# EAGLE design LogBoard (EAGLE 9.5.0)
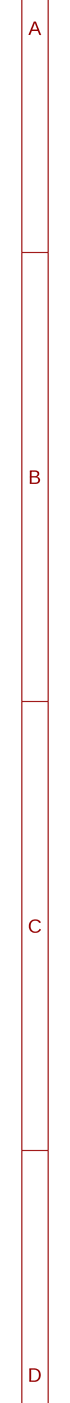
[diagram p0: schematic, sheet 1, part 1 of 2]
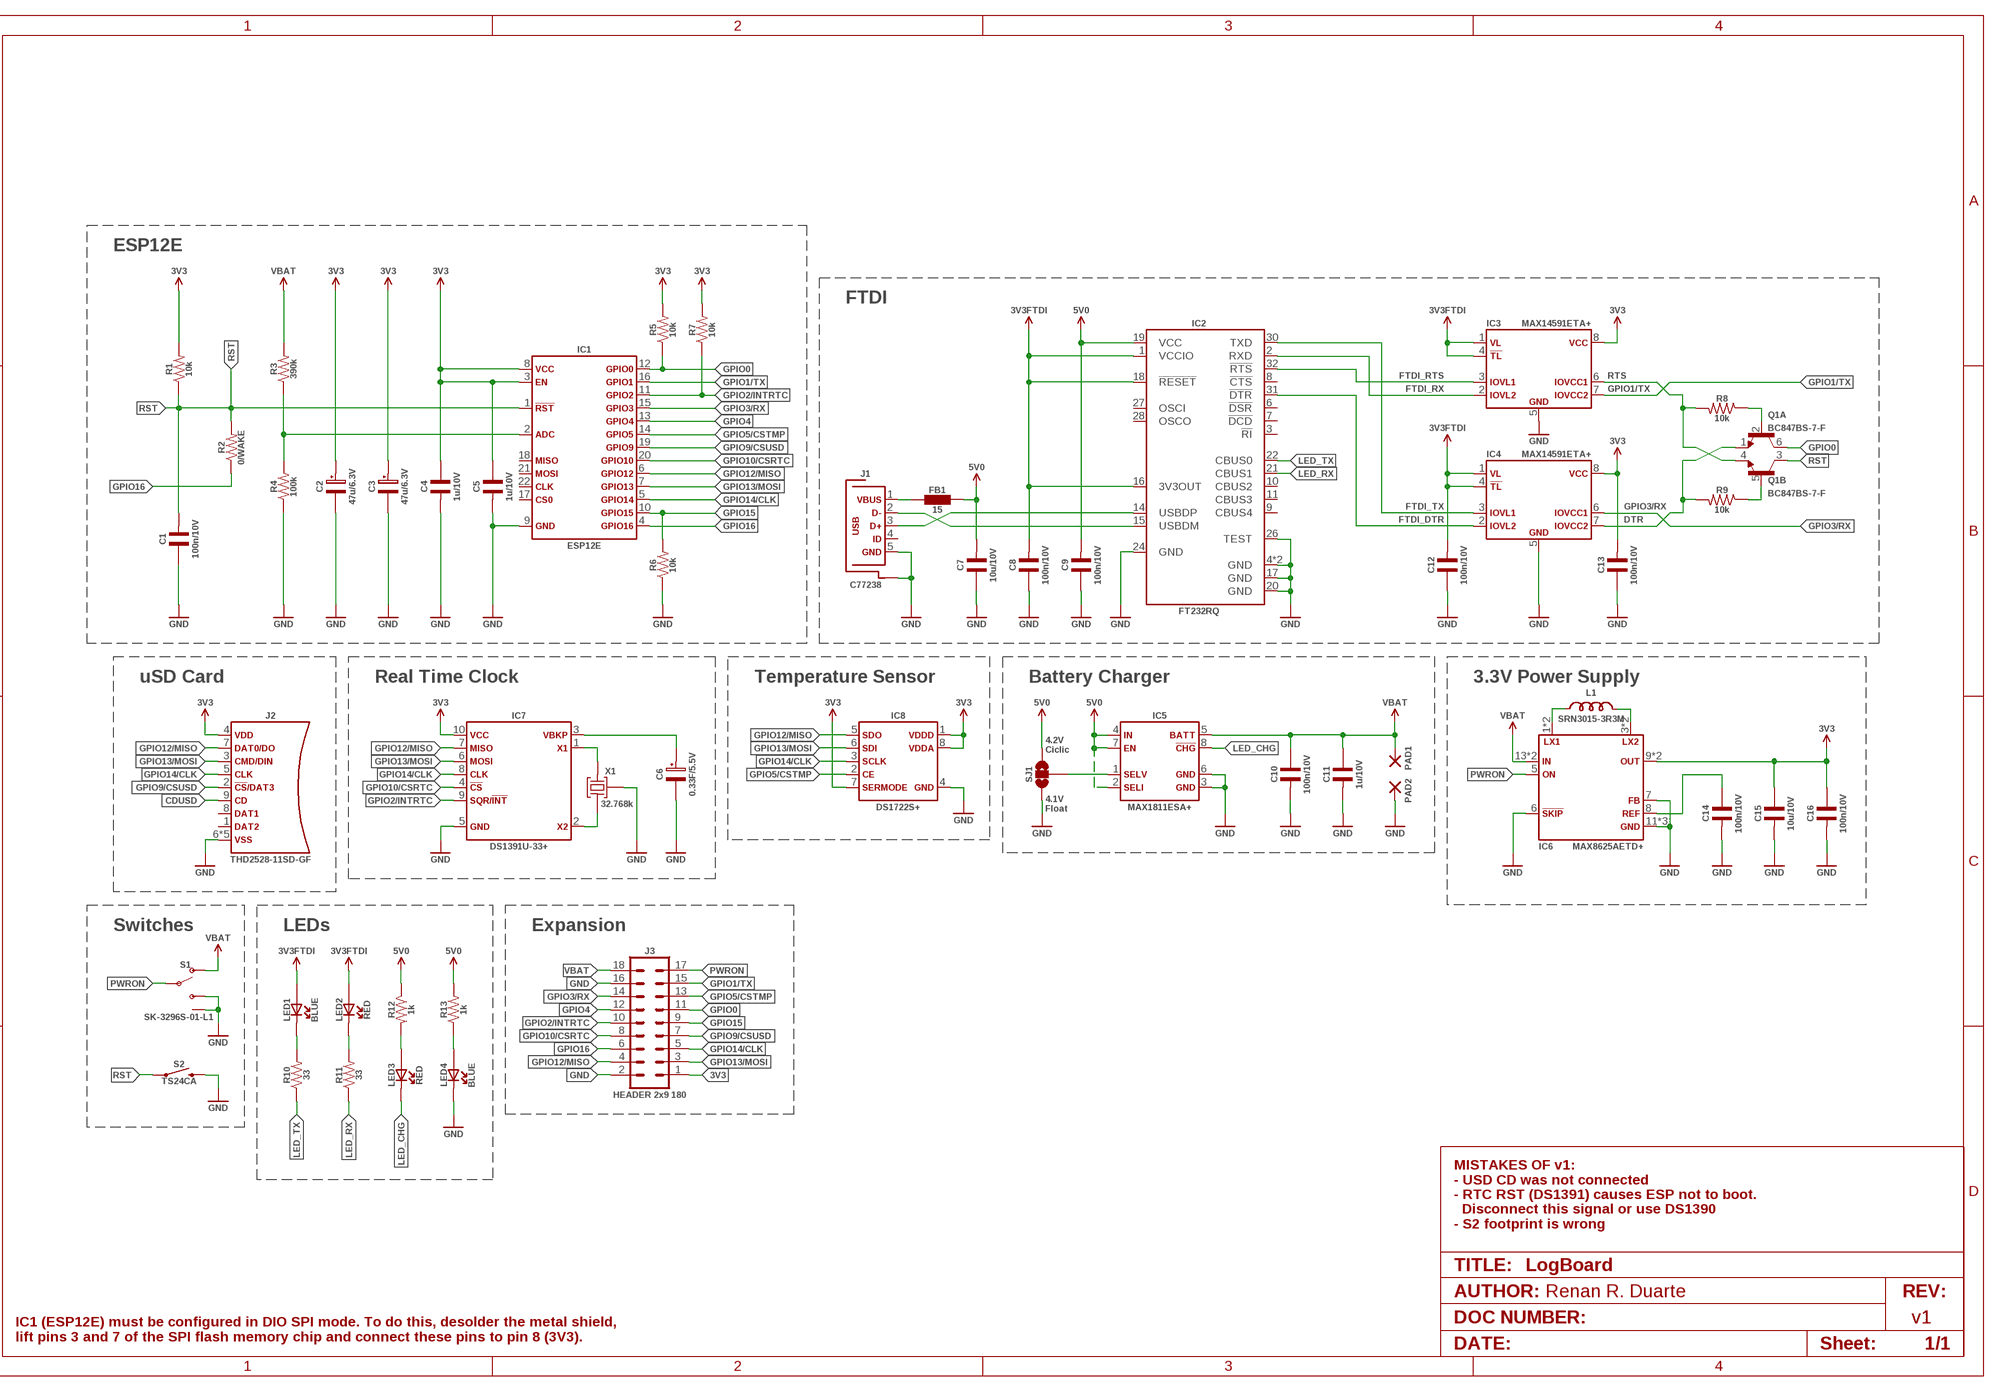
[diagram p1: schematic, sheet 1, part 2 of 2]

## Parts
C1  100n/10V  1-CAPACITORSMD-0603  [C-SMD-0603]
C2  47u/6.3V  1-CAPACITOR-POLCT3528  [C-SMD-CT3528]
C3  47u/6.3V  1-CAPACITOR-POLCT3528  [C-SMD-CT3528]
C4  1u/10V  1-CAPACITORSMD-0603  [C-SMD-0603]
C5  1u/10V  1-CAPACITORSMD-0603  [C-SMD-0603]
C6  0.33F/5.5V  1-CAPACITOR-POL5X11.5  [C-PTH-5X11.5]
C7  10u/10V  1-CAPACITORSMD-0603  [C-SMD-0603]
C8  100n/10V  1-CAPACITORSMD-0603  [C-SMD-0603]
C9  100n/10V  1-CAPACITORSMD-0603  [C-SMD-0603]
C10  100n/10V  1-CAPACITORSMD-0603  [C-SMD-0603]
C11  1u/10V  1-CAPACITORSMD-0603  [C-SMD-0603]
C12  100n/10V  1-CAPACITORSMD-0603  [C-SMD-0603]
C13  100n/10V  1-CAPACITORSMD-0603  [C-SMD-0603]
C14  100n/10V  1-CAPACITORSMD-0603  [C-SMD-0603]
C15  10u/10V  1-CAPACITORSMD-0603  [C-SMD-0603]
C16  100n/10V  1-CAPACITORSMD-0603  [C-SMD-0603]
FB1  15  FB-0603  [R-SMD-0603]
IC1  ESP12E  IC-ESP8266-12E*  [IC-ESP8266-12E]
IC2  FT232RQ  IC-FT232RQ  [IC-QFN32]
IC3  MAX14591ETA+  IC-MAX14591  [IC-TDFN8]
IC4  MAX14591ETA+  IC-MAX14591  [IC-TDFN8]
IC5  MAX1811ESA+  IC-MAX1811  [IC-SO8]
IC6  MAX8625AETD+  IC-MAX8625  [IC-TDFN14]
IC7  DS1391U-33+  IC-DS1394  [IC-USOP10]
IC8  DS1722S+  IC-DS1722  [IC-SO8]
J1  C77238  CN-MICRO-USB  [CN-MICRO-USB]
J2  THD2528-11SD-GF  CN-MICROSD  [CN-MICROSD]
J3  HEADER 2x9 180  PIN-HEADER-9X2  [PH-9X2-180]
L1  SRN3015-3R3M  2-INDUCTOR3X3  [L-SMD-3X3]
LED1  BLUE  LED0603  [LED-SMD-0603]
LED2  RED  LED0603  [LED-SMD-0603]
LED3  RED  LED0603  [LED-SMD-0603]
LED4  BLUE  LED0603  [LED-SMD-0603]
PAD1  SMD2  [SMD1,27-2,54]
PAD2  SMD2  [SMD1,27-2,54]
Q1  BC847BS-7-F  NPN-DUAL  [IC-SOT363]
R1  10k  0-RESISTORSMD-0603  [R-SMD-0603]
R2  0/WAKE  0-RESISTORSMD-0603  [R-SMD-0603]
R3  390k  0-RESISTORSMD-0603  [R-SMD-0603]
R4  100k  0-RESISTORSMD-0603  [R-SMD-0603]
R5  10k  0-RESISTORSMD-0603  [R-SMD-0603]
R6  10k  0-RESISTORSMD-0603  [R-SMD-0603]
R7  10k  0-RESISTORSMD-0603  [R-SMD-0603]
R8  10k  0-RESISTORSMD-0603  [R-SMD-0603]
R9  10k  0-RESISTORSMD-0603  [R-SMD-0603]
R10  33  0-RESISTORSMD-0603  [R-SMD-0603]
R11  33  0-RESISTORSMD-0603  [R-SMD-0603]
R12  1k  0-RESISTORSMD-0603  [R-SMD-0603]
R13  1k  0-RESISTORSMD-0603  [R-SMD-0603]
S1  SK-3296S-01-L1  SWITCH-SPDT-SMD-RIGHT-ANGLE  [SWITCH_SPST_SMD_A]
S2  TS24CA  MOMENTARY-SWITCH-SPST-SMD-RIGHT-ANGLE  [TACTILE_SWITCH_SMD_RIGHT_ANGLE]
SJ1  SJ-3  [SJ-3]
X1  32.768k  CRYSTAL  [CRYSTAL-SMD-7X1.5]

## Nets
3V3: C2.+(P) C3.+(P) C4.P$1 C5.P$1 C13.P$2 C15.P$1 C16.P$1 IC1.3(EN) IC1.8(VCC) IC3.8(VCC) IC4.8(VCC) IC6.9(OUT) IC6.10(OUT) IC7.10(VCC) IC8.1(VDDD) IC8.7(SERMODE) IC8.8(VDDA) J2.4(VDD) J3.1 R1.P$2 R5.P$2 R7.P$2
3V3FTDI: C8.P$2 C12.P$2 IC2.1(VCCIO) IC2.16(3V3OUT) IC2.18(!RESET) IC3.1(VL) IC3.4(!TL) IC4.1(VL) IC4.4(!TL) LED1.A LED2.A
5V0: C7.P$2 C9.P$2 FB1.P$2 IC2.19(VCC) IC5.2(SELI) IC5.4(IN) IC5.7(EN) R12.P$1 R13.P$2 SJ1.1
CDUSD: J2.9(CD)
DTR: IC4.7(IOVCC2) Q1.1(A:E) R9.P$2
FTDI_DTR: IC2.31(!DTR) IC4.2(IOVL2)
FTDI_RTS: IC2.32(!RTS) IC3.3(IOVL1)
FTDI_RX: IC2.2(RXD) IC3.2(IOVL2)
FTDI_TX: IC2.30(TXD) IC4.3(IOVL1)
GND: C1.P$1 C2.-(N) C3.-(N) C4.P$2 C5.P$2 C6.N C7.P$1 C8.P$1 C9.P$1 C10.P$2 C11.P$2 C12.P$1 C13.P$1 C14.P$2 C15.P$2 C16.P$2 IC1.9(GND) IC2.4(GND) IC2.17(GND) IC2.20(GND) IC2.24(GND) IC2.26(TEST) IC2.GND IC3.5(GND) IC4.5(GND) IC5.3(GND) IC5.6(GND) IC6.6(!SKIP) IC6.7(FB) IC6.11(GND) IC6.12(GND) IC6.TP(GND) IC7.5(GND) IC8.4(GND) J1.5(GND) J1.SHELL1(SHIELD) J1.SHELL2(SHIELD) J1.SHELL3(SHIELD) J1.SHELL(SHIELD) J2.6(VSS) J2.G1(VSS) J2.G2(VSS) J2.G3(VSS) J2.G4(VSS) J3.2 J3.16 LED4.C PAD2.1(P) R4.P$1 R6.P$1 S1.3(S) S1.GND1 S1.GND2 S1.GND3 S1.GND4 S2.2 SJ1.3 X1.3 X1.4
GPIO0: IC1.12(GPIO0) J3.11 Q1.6(A:C) R5.P$1
GPIO1/TX: IC1.16(GPIO1) IC3.7(IOVCC2) J3.15
GPIO2/INTRTC: IC1.11(GPIO2) IC7.9(INT) J3.10 R7.P$1
GPIO3/RX: IC1.15(GPIO3) IC4.6(IOVCC1) J3.14
GPIO4: IC1.13(GPIO4) J3.12
GPIO5/CSTMP: IC1.14(GPIO5) IC8.2(CE) J3.13
GPIO9/CSUSD: IC1.19(GPIO9) J2.2(CD_DAT3_CS) J3.7
GPIO10/CSRTC: IC1.20(GPIO10) IC7.4(CS) J3.8
GPIO12/MISO: IC1.6(GPIO12) IC7.7(MISO) IC8.5(SDO) J2.7(DAT0_DO) J3.4
GPIO13/MOSI: IC1.7(GPIO13) IC7.6(MOSI) IC8.6(SDI) J2.3(CMD_DIN) J3.3
GPIO14/CLK: IC1.5(GPIO14) IC7.8(CLK) IC8.3(SCLK) J2.5(CLK) J3.5
GPIO15: IC1.10(GPIO15) J3.9 R6.P$2
GPIO16: IC1.4(GPIO16) J3.6 R2.P$1
LED_CHG: IC5.8(!CHG) LED3.C
LED_RX: IC2.21(CBUS1) R11.P$1
LED_TX: IC2.22(CBUS0) R10.P$1
N$1: Q1.2(A:B) R8.P$1
N$2: Q1.5(B:B) R9.P$1
N$3: FB1.P$1 J1.1(VBUS)
N$4: IC2.15(USBDM) J1.2(D-)
N$5: IC2.14(USBDP) J1.3(D+)
N$6: LED1.C R10.P$2
N$7: LED2.C R11.P$2
N$8: LED3.A R12.P$2
N$10: IC5.1(SELV) SJ1.2
N$11: IC6.1(LX1) IC6.2(LX1) L1.P$1
N$16: IC6.3(LX2) IC6.4(LX2) L1.P$2
N$17: IC1.2(ADC) R3.P$1 R4.P$2
N$18: IC7.1(X1) X1.2
N$19: IC7.2(X2) X1.1
N$20: C14.P$1 IC6.8(REF)
N$22: LED4.A R13.P$1
PWRON: IC6.5(ON) J3.17 S1.2(P)
RST: C1.P$2 IC1.1(RST) Q1.3(B:C) R1.P$1 R2.P$2 S2.1
RTS: IC3.6(IOVCC1) Q1.4(B:E) R8.P$2
VBAT: C10.P$1 C11.P$1 IC5.5(BATT) IC6.13(IN) IC6.14(IN) J3.18 PAD1.1(P) R3.P$2 S1.1(O)
VBKP: C6.P IC7.3(VBKP)
Unconnected: IC1.17(CS0) IC1.18(MISO) IC1.21(MOSI) IC1.22(SCLK) IC2.3(!RI) IC2.6(!DSR) IC2.7(!DCD) IC2.8(!CTS) IC2.9(CBUS4) IC2.10(CBUS2) IC2.11(CBUS3) IC2.27(OSCI) IC2.28(OSCO) J1.4(ID) J2.1(DAT2) J2.8(DAT1)

## Notes on the sheet
- ESP12E
- FTDI
- uSD Card | Real Time Clock | Temperature Sensor | Battery Charger | 3.3V Power Supply
- 4.2V
  Ciclic
- 4.1V
  Float
- Switches | LEDs | Expansion
- MISTAKES OF v1:
  - USD CD was not connected
  - RTC RST (DS1391) causes ESP not to boot. 
    Disconnect this signal or use DS1390
  - S2 footprint is wrong
- Renan R. Duarte
- v1 | v1
- IC1 (ESP12E) must be configured in DIO SPI mode. To do this, desolder the metal shield,
  lift pins 3 and 7 of the SPI flash memory chip and connect these pins to pin 8 (3V3).

## Library data of the parts
C1 C4 C5 C7-C16 = 000_Renan_Duarte:1-CAPACITOR: Capacitors - European symbol Renan Duarte 2015
C2 C3 C6 = 000_Renan_Duarte:1-CAPACITOR-POL
FB1 = 000_Renan_Duarte:FB-: Ferrite Bead
IC1 = 000_Renan_Duarte:IC-ESP8266-12E: ESP8266-12E
IC2 = 000_Renan_Duarte:IC-FT232R: Source: http://www.ftdichip.com/Documents/DataSheets/DS_FT232R_v104.pdf; MPN: FT232RQ; OC_FARNELL: 1146033; OC_NEWARK: 91K9919
IC3 IC4 = 000_Renan_Duarte:IC-MAX14591
IC5 = 000_Renan_Duarte:IC-MAX1811: MAX1811 USB-Powered Li+ Charger Renan Duarte 2014
IC6 = 000_Renan_Duarte:IC-MAX8625
IC7 = 000_Renan_Duarte:IC-DS1394
IC8 = 000_Renan_Duarte:IC-DS1722
J1 = 000_Renan_Duarte:CN-MICRO-USB: WR-COM SMT Horizontal 5 Contacts Micro USB Type B,5 pins=>Code : Con_I-O_COM_MicroUSB_629105136821
J2 = 000_Renan_Duarte:CN-MICROSD: T-Flash Push-Out Micro SD Card Reader 14.75mm x 14.5mm SMD with external pins
J3 = 000_Renan_Duarte:PIN-HEADER-9X2: PIN HEADER; OC_FARNELL: unknown; OC_NEWARK: unknown
L1 = 000_Renan_Duarte:2-INDUCTOR: Inductors - American symbol Renan Duarte 2015
LED1-LED4 = 000_Renan_Duarte:LED: LED
PAD1 PAD2 = wirepad:SMD2: SMD PAD
Q1 = 000_Renan_Duarte:NPN-DUAL
R1-R13 = 000_Renan_Duarte:0-RESISTOR: Resistor -American symbol Renan Duarte 2015
S1 = SparkFun-Switches:SWITCH-SPDT: Single Pole, Double Throw (SPDT) Switch Single-pole, double-throw (SPDT) switch. Variant Overview SMD-AYZ0202 Surface Mount DPDT Switch <https://www.sparkfun.com/products/597> (COM-00597) Used on e.g. LilyPad Arduino USB - ATmega32U4 Board <https://www.sparkfun.com/products/12049> PTH-11.6X4.0MM SPDT Mini Power Switch <https://www.sparkfun.com/products/102> (COM-00102) Used on e.g. SparkFun Simon Says - Through-Hole Soldering Kit <https://www.sparkfun.com/products/10547> (KIT-10547) PTH-11.6X4.0MM-KIT KIT version of SPDT Mini Power Switch - Simplifies soldering by removing tStop of switch pins - only one side can be soldered. PTH-11.6X4.0MM-LOCK LOCK version of SPDT Mini Power Switch - Offset pins hold switch in place for easier soldering. SMD-RIGHT-ANGLE Surface Mount Right Angle Switch <https://www.sparkfun.com/products/10860> (COM-10860) Used on e.g. SparkFun ESP8266 Thing <https://www.sparkfun.com/products/13231>; PROD_ID: SWCH-10651; SF_SKU: COM-10860
S2 = SparkFun-Switches:MOMENTARY-SWITCH-SPST: Momentary Switch (Pushbutton) - SPST Normally-open (NO) SPST momentary switches (buttons, pushbuttons). Variants PTH-12MM - 12mm square, through-hole Momentary Pushbutton Switch - 12mm Square <https://www.sparkfun.com/products/9190> (COM-09190) PTH-6.0MM, PTH-6.0MM-KIT - 6.0mm square, through-hole Mini Pushbutton Switch <https://www.sparkfun.com/products/97> (COM-00097) KIT package intended for soldering kit's - only one side of pads' copper is exposed. PTH-RIGHT-ANGLE-KIT - Right-angle, through-hole Right Angle Tactile Button <https://www.sparkfun.com/products/10791> - Used on SparkFun BigTime Watch Kit <https://www.sparkfun.com/products/11734> SMD-12MM - 12mm square, surface-mount Tactile Button - SMD (12mm) <https://www.sparkfun.com/products/12993> (COM-12993) Used on SparkFun PicoBoard <https://www.sparkfun.com/products/11888> SMD-4.5MM - 4.5mm Square Trackball Switch Used on SparkFun Blackberry Trackballer Breakout <https://www.sparkfun.com/products/13169> SMD-4.6MMX2.8MM - 4.60mm x 2.80mm, surface mount Used on SparkFun SAMD21 Mini Breakout <https://www.sparkfun.com/products/13664> SMD-5.2MM, SMD-5.2-REDUNDANT - 5.2mm square, surface-mount Mini Pushbutton Switch - SMD <https://www.sparkfun.com/products/8720> (COM-08720) Used on Arduino Pro Mini <https://www.sparkfun.com/products/11114> REDUNDANT package connects both switch circuits together SMD-6.0X3.5MM - 6.0 x 3.5mm, surface mount Momentary Reset Switch SMD <https://www.sparkfun.com/products/8229> (COM-08229) SMD-6.2MM-TALL - 6.2mm square, surface mount Tactile Button - SMD (6mm) <https://www.sparkfun.com/products/12992> Used on SparkFun Digital Sandbox <https://www.sparkfun.com/products/12651> SMD-RIGHT-ANGLE - Right-angle, surface mount Used on SparkFun Block for Intel® Edison - Arduino <https://www.sparkfun.com/products/13036>; PROD_ID: COMP-12265
SJ1 = 000_Renan_Duarte:SJ-3: SMD solder JUMPER
X1 = 000_Renan_Duarte:CRYSTAL

## Board
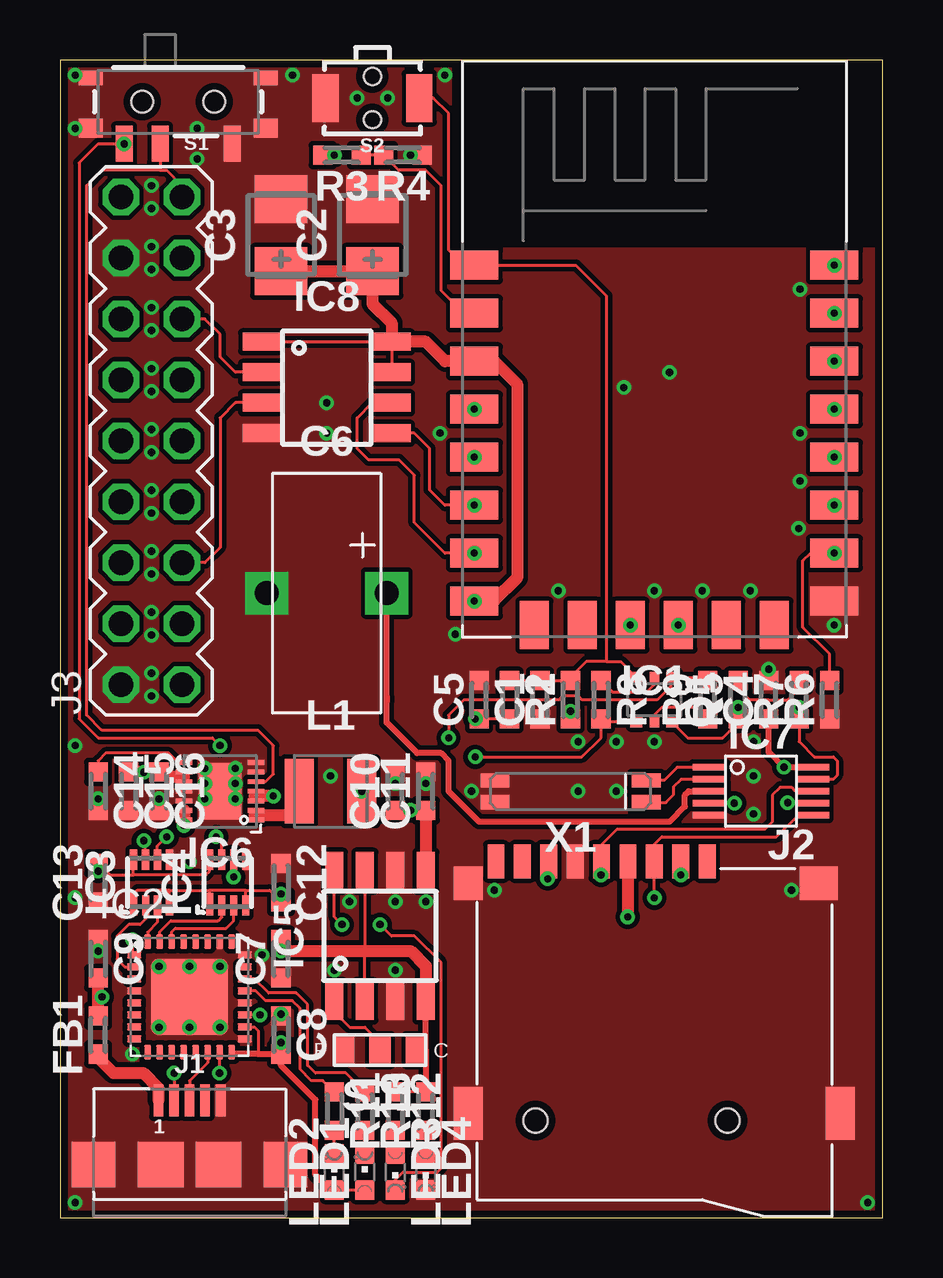
[diagram p2: board, top side]
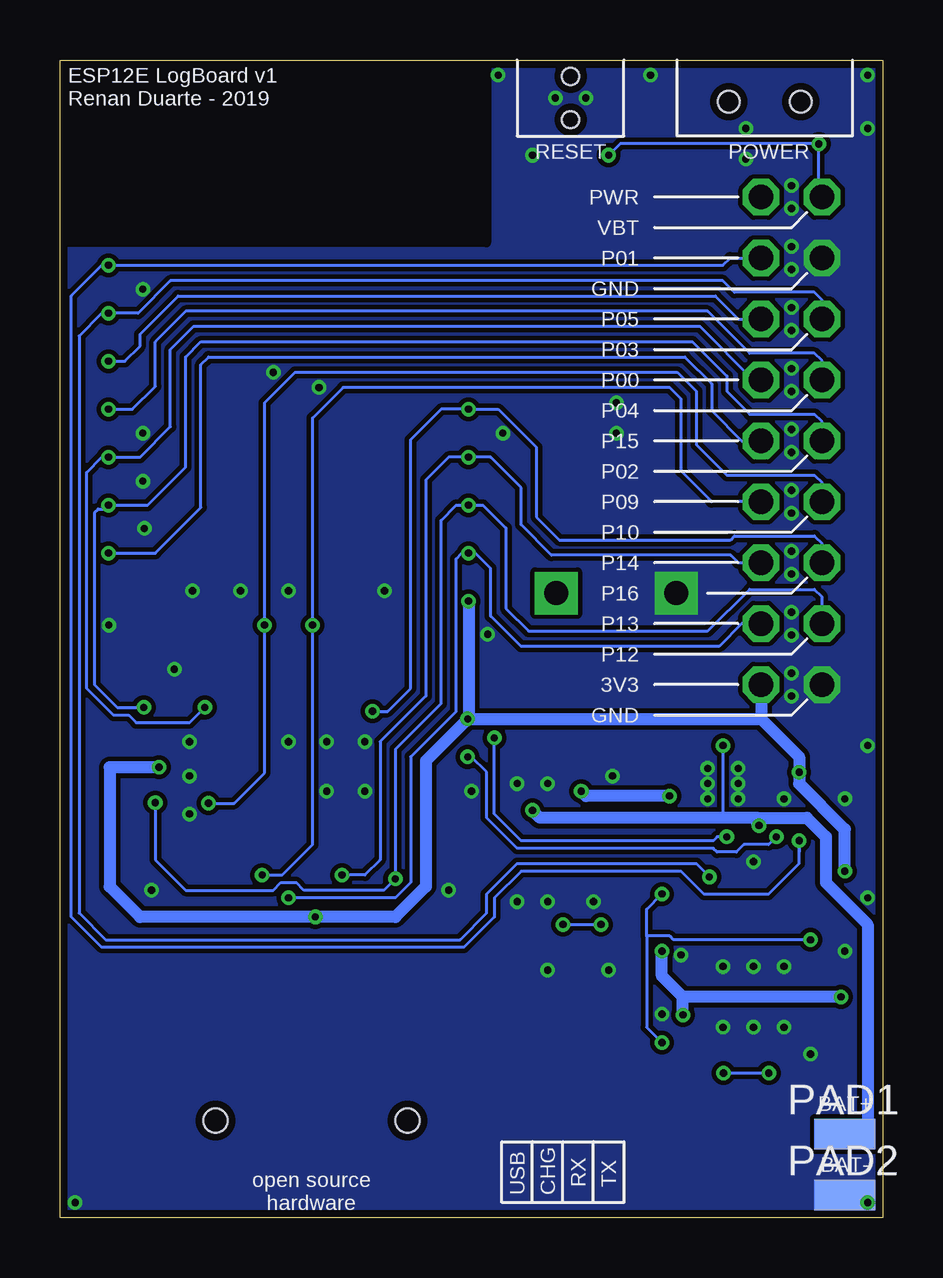
[diagram p3: board, bottom side, seen from below]

Size 34.29 x 48.26 mm. Coordinates in mm from the lower left corner, seen from the top.
Outline: 0,0 34.29,0 34.29,48.26 0,48.26 0,0
Copper layers (1*16): Top 0.035mm / dielectric 0.93mm / Bottom 0.035mm
Design rules "default *": minimum track width 5mil, minimum drill 0.3mm, track to track 5mil, track to pad 5mil, pad to pad 5mil, via to via 5mil, smd to smd 0mil, copper to edge 12.5mil, drill to drill 12.5mil, minimum pad ring 10mil, minimum via ring 6mil, stop-mask expansion 4mil, vias tented up to drill 0.3mm, thermal gap 0mil
tRestrict: area 16.5,40.6 to 34.3,48.3
bRestrict: area 16.5,40.6 to 34.3,48.3

### Footprints (pad centres in the part's own frame; a part is rotated, then mirrored left to right if it is on the bottom)
C-SMD-0603 = smd 0.8 x 0.8: P$1 -0.8,0; P$2 0.8,0
C-SMD-CT3528 = smd 2 x 2.2: + -1.5,0; - 1.5,0
C-PTH-5X11.5 = drill 1 pad 1.778 square: N -2.5,0; P 2.5,0
R-SMD-0603 = smd 0.8 x 0.8: P$1 -0.8,0; P$2 0.8,0
IC-ESP8266-12E = smd 2 x 1.2: 1 -7.5,7; 2 -7.5,5; 3 -7.5,3; 4 -7.5,1; 5 -7.5,-1; 6 -7.5,-3; 7 -7.5,-5; 8 -7.5,-7; 9 7.5,-7; 10 7.5,-5; 11 7.5,-3; 12 7.5,-1; 13 7.5,1; 14 7.5,3; 15 7.5,5; 16 7.5,7 | smd 1.2 x 2: 17 -5,-8; 18 -3,-8; 19 -1,-8; 20 1,-8; 21 3,-8; 22 5,-8
IC-QFN32 = smd 0.6 x 0.3: 1 -2.3,1.75; 2 -2.3,1.25; 3 -2.3,0.75; 4 -2.3,0.25; 5 -2.3,-0.25; 6 -2.3,-0.75; 7 -2.3,-1.25; 8 -2.3,-1.75; 17 2.3,-1.75; 18 2.3,-1.25; 19 2.3,-0.75; 20 2.3,-0.25; 21 2.3,0.25; 22 2.3,0.75; 23 2.3,1.25; 24 2.3,1.75 | smd 0.3 x 0.6: 9 -1.75,-2.3; 10 -1.25,-2.3; 11 -0.75,-2.3; 12 -0.25,-2.3; 13 0.25,-2.3; 14 0.75,-2.3; 15 1.25,-2.3; 16 1.75,-2.3; 25 1.75,2.3; 26 1.25,2.3; 27 0.75,2.3; 28 0.25,2.3; 29 -0.25,2.3; 30 -0.75,2.3; 31 -1.25,2.3; 32 -1.75,2.3 | smd 3.2 x 3.2: GND 0,0
IC-TDFN8 = smd 0.95 x 0.3: 1 -0.9,0.75 | smd 0.85 x 0.3: 2 -0.95,0.24; 3 -0.95,-0.25; 4 -0.95,-0.75; 5 0.95,-0.75; 6 0.95,-0.25; 7 0.95,0.25; 8 0.95,0.75
IC-SO8 = smd 1.6 x 0.75: 1 -2.7,1.905; 2 -2.7,0.635; 3 -2.7,-0.635; 4 -2.7,-1.905; 5 2.7,-1.905; 6 2.7,-0.635; 7 2.7,0.635; 8 2.7,1.905
IC-TDFN14 = smd 0.7 x 0.2: 1 -1.5,1.2; 2 -1.5,0.8; 3 -1.5,0.4; 4 -1.5,0; 5 -1.5,-0.4; 6 -1.5,-0.8; 7 -1.5,-1.2; 8 1.5,-1.2; 9 1.5,-0.8; 10 1.5,-0.4; 11 1.5,0; 12 1.5,0.4; 13 1.5,0.8; 14 1.5,1.2 | smd 1.78 x 2.35: TP 0,0
IC-USOP10 = smd 1.4 x 0.28: 1 -2.14,1; 2 -2.14,0.5; 3 -2.14,0; 4 -2.14,-0.5; 5 -2.14,-1; 6 2.14,-1; 7 2.14,-0.5; 8 2.14,0; 9 2.14,0.5; 10 2.14,1
CN-MICRO-USB = smd 0.4 x 1.35: 1 -1.3,2.675; 2 -0.65,2.675; 3 0,2.675; 4 0.65,2.675; 5 1.3,2.675 | smd 1.8 x 1.9: SHELL -4,0; SHELL3 4,0 | smd 1.9 x 1.9: SHELL1 -1.2,0; SHELL2 1.2,0
CN-MICROSD = smd 0.7 x 1.4: 1 2.2,7.55; 2 1.1,7.55; 3 0,7.55; 4 -1.1,7.55; 5 -2.2,7.55; 6 -3.3,7.55; 7 -4.4,7.55; 8 -5.5,7.55; 9 -6.6,7.55 | smd 1.2 x 1.4: G1 -7.75,6.65 | smd 1.2 x 2.2: G2 -7.75,-2.95; G4 7.75,-2.95 | smd 1.6 x 1.4: G3 6.85,6.65 | hole 1: 3.05,-3.25; -4.95,-3.25
PH-9X2-180 = drill 1.016 octagon: 1 -10.16,-1.27; 2 -10.16,1.27; 3 -7.62,-1.27; 4 -7.62,1.27; 5 -5.08,-1.27; 6 -5.08,1.27; 7 -2.54,-1.27; 8 -2.54,1.27; 9 0,-1.27; 10 0,1.27; 11 2.54,-1.27; 12 2.54,1.27; 13 5.08,-1.27; 14 5.08,1.27; 15 7.62,-1.27; 16 7.62,1.27; 17 10.16,-1.27; 18 10.16,1.27
L-SMD-3X3 = smd 1.2 x 2.7: P$1 -1.3,0; P$2 1.3,0
LED-SMD-0603 = smd 0.8 x 0.8: A 0,-0.75; C 0,0.75
SMD1,27-2,54 = smd 1.27 x 2.54: 1 0,0
IC-SOT363 = smd 0.5 x 0.5: 1 -0.9,0.75; 3 -0.9,-0.75; 4 0.9,-0.75; 6 0.9,0.75 | smd 0.5 x 0.4: 2 -0.9,0; 5 0.9,0
SWITCH_SPST_SMD_A = smd 0.7 x 1.5: 1 -2.25,-1.75; 2 -0.75,-1.75; 3 2.25,-1.75 | smd 1 x 0.6: GND1 -3.65,1; GND3 3.65,1 | smd 1 x 0.8: GND2 -3.65,-1.1; GND4 3.65,-1.1 | hole 0.9: -1.5,0; 1.5,0
TACTILE_SWITCH_SMD_RIGHT_ANGLE = smd 1.1 x 2: 1 -1.95,0; 2 1.95,0 | hole 0.7: 0,0.9; 0,-0.9
SJ-3 = smd 0.9 x 1.2: 1 -1.524,0; 2 0,0; 3 1.524,0
CRYSTAL-SMD-7X1.5 = smd 0.6 x 1.2: 1 -0.45,-3.15; 2 0.45,-3.15; 3 0.45,3.15; 4 -0.45,3.15

### Placement (x,y rotation side)
C1  20,21.59 90 top
C2  13.02,40.96 90 top
C3  9.21,40.96 90 top
C4  29.53,21.59 90 top
C5  17.46,21.59 90 top
C6  11.11,26.04 0 top
C7  9.21,10.79 90 top
C8  9.21,7.62 270 top
C9  1.59,10.79 270 top
C10  13.97,17.78 90 top
C11  15.24,17.78 90 top
C12  9.21,13.97 270 top
C13  1.59,13.97 90 top
C14  1.59,17.78 270 top
C15  2.86,17.78 270 top
C16  4.13,17.78 270 top
FB1  1.59,7.62 90 top
IC1  24.77,32.7 0 top
IC2  5.4,9.21 0 top
IC3  3.81,13.97 90 top
IC4  6.99,13.97 90 top
IC5  13.34,11.75 90 top
IC6  6.67,17.78 180 top
IC7  29.21,17.78 0 top
IC8  11.11,34.61 0 top
J1  5.4,2.22 0 top
J2  24.77,7.3 0 top
J3  3.81,32.38 90 top
L1  11.27,17.78 0 top
LED1  12.7,1.91 0 top
LED2  11.43,1.91 0 top
LED3  13.97,1.91 180 top
LED4  15.24,1.91 180 top
PAD1  1.59,3.49 270 bottom
PAD2  1.59,0.95 270 bottom
Q1  24.77,21.59 270 top
R1  18.73,21.59 270 top
R2  21.27,21.59 90 top
R3  11.75,44.29 180 top
R4  14.29,44.29 180 top
R5  28.26,21.59 90 top
R6  32.07,21.59 90 top
R7  30.8,21.59 90 top
R8  22.54,21.59 270 top
R9  26.99,21.59 90 top
R10  12.7,4.45 270 top
R11  11.43,4.45 270 top
R12  13.97,4.45 270 top
R13  15.24,4.45 90 top
S1  4.92,46.51 0 top
S2  13.02,46.67 180 top
SJ1  13.34,6.99 180 top
U$7  [OSHW_5MM]  23.81,4.13 0 bottom
X1  21.27,17.78 90 top

### Tracks (layer width: path | path; a pad name or v marks a point on that pad's centre or on a via)
3V3  (via drill 0.3)
  Top 0.127: 3.06,14.29 IC3.8 | IC4.8 6.24,14.45 6.08,14.29 3.06,14.29 | IC6.10 5.17,18.38 IC6.9 | C13.P$2 v1.59,14.45 1.91,14.45 2.06,14.29 3.06,14.29 | C15.P$1 v3.49,18.57 | R7.P$2 30.8,22.07 30.32,21.59 29.53,21.59 | 29.53,21.59 28.73,21.59 28.26,22.07 R5.P$2 | C4.P$1 29.53,21.59 | R1.P$2 C5.P$1 v17.31,20.79 v17.3,20.8 | IC8.7 IC8.8 IC8.1
  Top 0.254: IC7.10 v30.16,18.78 29.53,19.41 C4.P$1
  Top 0.508: 5.17,18.38 4.6,18.38 4.4,18.58 C16.P$1 C15.P$1 | J2.4 v23.65,12.54 | IC1.8 17.78,25.7 | 16.81,25.7 IC1.8 | IC1.8 17.46,25.5 | IC1.8 18.08,25.7 19.05,26.67 19.05,34.75 18.1,35.7 IC1.3 16.05,35.7 15.24,36.51 IC8.8 13.81,37.3 13.02,38.1 C2.+ C3.+
  Bottom 0.508: v17.3,20.8 19.05,19.05 19.05,13.81 20.32,12.54 v23.65,12.54 30.96,12.54 32.23,13.81 32.23,18.78 v30.16,18.78 | v17.3,20.8 5.08,20.8 | v1.59,14.45 1.59,16.19 3.49,18.1 v3.49,18.57 3.49,19.21 5.08,20.8 | J3.1 5.08,20.8 | IC1.8 17.27,20.84 v17.3,20.8
  other vias: 17.27,25.7
3V3FTDI  (via drill 0.3)
  Top 0.127: IC3.4 4.56,13.65 | C8.P$2 9.21,6.59 | v3.02,11.59 3.02,11.04 IC2.1 | IC3.1 3.06,13.49 3.22,13.65 4.56,13.65 | 4.56,13.65 6.24,13.65 | IC4.1 6.24,13.65 | C12.P$2 v9.21,13.49 8.89,13.49 8.73,13.65 7.74,13.65 | 7.74,13.65 6.24,13.65 | IC4.4 7.74,13.65 | v9.21,7.3 C8.P$2 | LED1.A LED2.A | IC2.18 8.1,7.96 8.26,7.8 8.26,6.83
  Top 0.254: LED2.A 11.27,1.16 10.64,1.79 10.64,4.92 9.21,6.35 C8.P$2 8.26,6.83 7.23,6.83 IC2.16
  Bottom 0.127: v9.21,7.3 9.84,7.94 9.84,11.75 | 9.84,11.75 9.84,12.86 v9.21,13.49 | v3.02,11.59 8.73,11.59 8.89,11.75 9.84,11.75
5V0  (via drill 0.3)
  Top 0.127: IC5.4 | v8.33,8.46 IC2.19 | R13.P$2 R12.P$1 | SJ1.1 15.24,6.99 | IC5.2 12.7,11.12 IC5.7 | v1.75,9.21 FB1.P$2
  Top 0.254: IC5.4 15.24,6.99 R13.P$2
  Top 0.508: FB1.P$2 C9.P$2 | 9.21,11.43 C7.P$2 v9.21,11.12 | v9.21,11.12 12.7,11.12 14.61,11.12 15.24,10.48 IC5.4 | v9.21,11.11 v9.21,11.12
  Bottom 0.508: v8.33,8.46 8.33,9.21 | 8.33,9.21 9.21,10.08 v9.21,11.11 | v1.75,9.21 8.33,9.21
DTR  (via drill 0.3)
  Top 0.127: v6.51,15.88 6.74,15.65 IC4.7 | R9.P$2 26.89,22.49 Q1.1 25.52,22.36 25.42,22.13 24.88,21.59 21.75,21.59 21.59,21.75 20.95,21.75 20.8,21.59 16.83,21.59 16.19,20.95 v16.19,20
  Bottom 0.127: v6.51,15.88 6.91,15.88 7.06,15.72 15.08,15.72 16.19,16.83 v16.19,20
FTDI_DTR
  Top 0.127: IC2.31 4.15,11.91 4.62,12.38 6.59,12.38 6.75,12.54 IC4.2
FTDI_RTS
  Top 0.127: IC3.3 4.06,12.31 3.65,11.9 IC2.32
FTDI_RX
  Top 0.127: IC2.2 2.7,10.46 2.38,10.78 2.38,11.75 2.86,12.22 3.33,12.22 3.57,12.46 IC3.2
FTDI_TX
  Top 0.127: IC2.30 4.65,11.91 4.81,12.06 6.92,12.06 7.24,12.38 IC4.3
GND  (via drill 0.3)
  other vias: 4.13,7.94 4.13,10.48 6.67,10.48 6.67,7.94 7.3,18.73 7.3,17.46 6.03,17.46 6.03,18.73 30.78,28.73 3.81,37.94 3.81,36.99 3.81,22.7 3.81,21.75 3.81,25.24 3.81,24.29 3.81,27.78 3.81,26.83 3.81,30.32 3.81,29.37 3.81,32.86 3.81,31.91 3.81,35.4 3.81,34.45 3.81,40.48 3.81,39.53 3.81,43.02 3.81,42.07 15.84,32.7 16.47,24.32 28.77,26.13 26.77,26.13 24.77,26.13 20.77,26.13 30.84,30.7 30.84,32.7 30.84,38.7 28.89,18.41 28.89,16.83 23.18,17.78 21.59,17.78 17.14,17.78 15.24,18.1 13.97,18.1 1.59,17.46 4.13,17.46 1.59,11.11 29.53,22.86 30.48,13.65 18.1,13.65 32.26,24.7 25.4,35.24 23.5,34.61 21.59,19.84 23.18,19.84 24.77,19.84 28.89,19.84 7.3,18.1 6.03,18.1 12.06,13.18 13.97,13.18 13.97,10.32 11.43,10.32 15.24,13.18 8.41,10.95 5.4,10.48 5.4,7.94 3.02,6.83 9.68,47.62 0.64,45.4 5.71,44.13 5.71,45.4 13.65,46.67 14.61,44.29 16.03,47.62 0.64,47.62 0.64,0.64 33.66,0.64 0.64,19.68 0.64,13.34 12.38,46.67 11.27,18.41 11.11,33.97 11.11,32.7 5.4,14.84 9.21,8.49
  pour Top (isolate 0.191, rank 2, no thermals): 0,48.26 0,0 34.29,0 34.29,48.26
  pour Bottom (isolate 0.191): 0,0 34.29,0 34.29,48.26 0,48.26
GPIO0  (via drill 0.3)
  Top 0.127: Q1.6 25.52,20.64 26.15,20 27.62,20 28.26,20.64 R5.P$1 v28.26,21.27
  Bottom 0.127: v28.26,21.27 28.89,20.64 31.11,20.64 31.43,20.95 32.07,20.95 33.18,22.07 33.18,31.07 32.54,31.7 IC1.12 30.96,31.7 29.69,32.97 29.69,36.2 28.73,37.15 7.62,37.15 5.4,34.92 J3.11
  other vias: 32.27,31.7
GPIO1/TX  (via drill 0.3)
  Top 0.127: IC3.7 3.56,15.65 v3.49,15.72
  Bottom 0.127: 3.49,15.24 v3.49,15.72 3.49,14.76 4.76,13.49 7.46,13.49 8.41,14.45 15.08,14.45 16.19,13.34 16.19,12.54 17.46,11.27 32.54,11.27 33.81,12.54 33.81,38.43 32.54,39.7 IC1.16 6.67,39.7 6.37,40.01 J3.15
  other vias: 32.27,39.7
GPIO2/INTRTC  (via drill 0.3)
  Top 0.127: IC7.9 32.23,18.28 32.38,18.44 32.38,19.05 32.23,19.21 31.43,19.21 30.8,19.84 R7.P$1 v30.8,21.27
  Bottom 0.127: v30.8,21.27 31.91,21.27 32.86,22.23 32.86,29.39 32.7,29.54 32.42,29.54 IC1.11 30.64,29.7 29.05,31.29 29.05,35.88 28.42,36.51 7.94,36.51 6.51,35.08 6.51,34.45 5.56,33.5 2.86,33.5 2.54,33.18 J3.10
  other vias: 32.27,29.7
GPIO3/RX  (via drill 0.3)
  Top 0.127: IC4.6 v7.24,14.21 | IC1.15 31.6,37.7
  Bottom 0.127: J3.14 2.54,38.26 2.86,38.58 6.19,38.58 6.67,39.05 29.69,39.05 31.04,37.7 IC1.15 32.54,37.7 33.5,36.75 33.5,12.7 32.38,11.59 17.62,11.59 16.51,12.7 16.51,13.49 15.24,14.76 7.78,14.76 7.39,14.38 v7.24,14.21
  other vias: 32.27,37.7
GPIO4  (via drill 0.3)
  Bottom 0.127: IC1.13 31.27,33.7 30.32,34.66 30.32,36.51 29.05,37.78 7.3,37.78 5.56,36.04 2.86,36.04 2.54,35.72 J3.12
  other vias: 32.27,33.7
GPIO5/CSTMP  (via drill 0.3)
  Top 0.127: IC8.2 7.3,35.24 6.67,35.88 6.67,36.83 6.03,37.47 J3.13
  Bottom 0.127: IC1.14 31.59,35.7 30.96,36.34 30.96,36.83 29.37,38.42 6.99,38.42 6.03,37.47 J3.13
  other vias: 32.27,35.7
GPIO9/CSUSD  (via drill 0.3)
  Top 0.127: J2.2 v25.86,14.29
  Bottom 0.127: v25.86,14.29 25.04,14.29 23.77,15.56 IC1.19 23.77,33.34 22.5,34.61 8.89,34.61 8.41,34.13 8.41,31.11 7.14,29.84 J3.7
  other vias: 23.77,24.7
GPIO10/CSRTC  (via drill 0.3)
  Top 0.127: v28.1,17.28 IC7.4
  Bottom 0.127: 25.77,24.72 IC1.20 | v28.1,17.28 27.04,17.28 25.77,18.55 IC1.20 | IC1.20 25.77,33.97 24.5,35.24 8.57,35.24 7.78,34.45 7.78,32.23 6.51,30.96 2.86,30.96 2.54,30.64 J3.8
  other vias: 25.77,24.7
GPIO12/MISO  (via drill 0.3)
  Top 0.127: J2.7 v20.32,14.13 | IC7.7 31.35,17.3 v30.32,17.3 | IC1.6 16.03,29.7 15.4,30.34 15.4,32.07 14.76,32.7 IC8.5
  Bottom 0.127: v30.32,17.3 30.32,14.92 29.05,13.65 25.4,13.65 25.08,13.97 24.45,13.97 24.13,13.65 20.8,13.65 v20.32,14.13 20.32,19.53 18.41,21.43 18.41,29.07 17.78,29.7 IC1.6 16.67,29.7 15.72,28.75 15.72,25.4 14.76,24.45 7.3,24.45 5.56,26.19 2.86,26.19 2.54,25.88 J3.4
  other vias: 17.27,29.7
GPIO13/MOSI  (via drill 0.3)
  Top 0.127: v24.77,13.34 J2.3 24.77,15.56 25.08,15.88 29.84,15.88 30.75,16.78 IC7.6 | IC1.7 16.03,27.7 14.76,28.97 14.76,30.96 14.13,31.59 12.86,31.59 12.38,32.07 12.38,33.34 13.02,33.97 IC8.6
  Bottom 0.127: v24.77,13.34 20.32,13.34 19.68,13.97 19.68,19.21 17.78,21.11 17.78,27.46 17.54,27.7 IC1.7 | J3.3 5.87,24.77 6.83,23.81 15.08,23.81 16.35,25.08 16.35,27.07 16.99,27.7 IC1.7 | 17.07,27.7 IC1.7
  other vias: 17.27,27.7
GPIO14/CLK  (via drill 0.3)
  Top 0.127: IC7.8 30.64,17.78 30.48,17.94 30,17.94 29.69,17.62 29.69,16.51 29.37,16.19 23.2,16.19 22.57,15.56 J2.5 v22.54,14.29 | IC8.3 7.3,33.97 6.67,33.34 6.67,27.94 6.03,27.3 J3.5
  Bottom 0.127: IC1.5 17.46,31.7 | IC1.5 18.1,31.7 19.05,30.75 19.05,21.75 20.95,19.84 20.95,14.92 21.59,14.29 v22.54,14.29 | J3.5 6.03,27.3 6.35,27.62 13.81,27.62 15.08,28.89 15.08,30.43 16.35,31.7 IC1.5
  other vias: 17.27,31.7
GPIO15  (via drill 0.3)
  Top 0.127: IC1.10 31.27,27.7 30.96,27.39 30.96,24.61 32.07,23.5 R6.P$2
  Bottom 0.127: IC1.10 30.32,27.7 28.42,29.61 28.42,35.56 28.1,35.88 8.26,35.88 7.14,34.77 7.14,33.66 5.87,32.38 J3.9
  other vias: 32.27,27.7
GPIO16  (via drill 0.3)
  Top 0.127: R2.P$1 v21.27,21.11
  Bottom 0.127: v21.27,21.11 20.64,21.11 19.68,22.07 19.68,32.43 18.41,33.7 IC1.4 16.03,33.7 14.45,32.12 14.45,29.21 13.49,28.26 6.35,28.26 6.19,28.42 2.86,28.42 2.54,28.1 J3.6
  other vias: 17.27,33.7
LED_CHG  (via drill 0.3)
  Top 0.127: 11.43,13.81 IC5.8 11.43,12.54 v11.75,12.22 | LED3.C 13.97,1.59 14.29,1.91 15.72,1.91 15.88,2.06 15.88,10.64 14.76,11.75 13.81,11.75 v13.34,12.22
  Bottom 0.127: v13.34,12.22 v11.75,12.22
LED_RX
  Top 0.127: R11.P$1 10.95,5.71 10.48,5.71 10,6.19 10,8.73 9.68,9.05 8.57,9.05 8.16,9.46 IC2.21
LED_TX
  Top 0.127: R10.P$1 11.91,6.03 10.64,6.03 10.32,6.35 10.32,8.89 9.84,9.37 8.69,9.37 8.1,9.96 IC2.22
N$1
  Top 0.127: R8.P$1 23.02,21.91 24.45,21.91 24.77,22.23 Q1.2
N$2
  Top 0.127: R9.P$1 26.5,21.27 25.08,21.27 24.77,20.95 Q1.5
N$3
  Top 0.508: FB1.P$1 1.59,6.67 2.22,6.03 3.46,6.03 4.1,5.4 J1.1
N$4  (via drill 0.3)
  Top 0.127: v6.65,6.03 IC2.15 | v4.76,6.03 4.76,4.75 J1.2
  Bottom 0.127: v6.65,6.03 v4.76,6.03
N$5
  Top 0.127: IC2.14 6.15,6.46 5.4,5.71 J1.3
N$6
  Top 0.127: LED1.C R10.P$2
N$7
  Top 0.127: LED2.C R11.P$2
N$8
  Top 0.127: R12.P$2 LED3.A
N$10
  Top 0.127: IC5.1 11.43,8.57 12.06,7.94 12.7,7.94 13.34,7.3 SJ1.2
N$11
  Top 0.127: IC6.1 IC6.2 8.1,16.98 8.1,16.77
  Top 0.508: L1.P$1 10,16.77 8.1,16.77
N$16  (via drill 0.3)
  Top 0.127: IC6.3 8.17,17.58 IC6.4
  Top 0.508: v8.89,17.58 8.17,17.58 8.1,17.58
  Bottom 0.508: v8.89,17.58 12.37,17.58 L1.P$2
  other vias: 12.57,17.78
N$17
  Top 0.127: IC1.2 16.83,37.7 15.88,38.66 15.88,43.02 15.24,43.66 14.12,43.66 R4.P$2 R3.P$1
N$18
  Top 0.127: IC7.1 25.72,18.78 25.19,18.25 24.44,18.25 X1.2
N$19
  Top 0.127: IC7.2 25.88,18.28 25.56,17.96 25.56,17.63 25.24,17.31 24.44,17.31 X1.1
N$20
  Top 0.127: IC6.8 4.92,18.98 4.53,19.37 1.91,19.37 1.59,19.05 C14.P$1
N$22
  Top 0.127: R13.P$1 LED4.A
PWRON
  Top 0.127: IC6.5 8.57,18.18 8.89,18.5 8.89,19.68 8.26,20.32 1.75,20.32 1.11,20.95 1.11,43.02 1.75,43.66 4.17,43.66 | 4.17,44.18 S1.2 4.17,43.66 | 4.17,43.66 4.45,43.66 5.08,43.02 J3.17
RST
  Top 0.127: S2.1 15.56,46.67 16.19,46.04 16.19,40.34 16.83,39.7 IC1.1 21.5,39.7 22.77,38.43 22.77,23.18 | 22.77,23.18 23.37,23.18 24.02,22.53 Q1.3 | 22.77,23.18 21.92,23.18 21.37,22.63 R2.P$2 C1.P$2 R1.P$1
RTS  (via drill 0.3)
  Top 0.127: IC3.6 4.06,15.49 v4.45,15.88 | Q1.4 22.54,20.69 R8.P$2 22.54,20 21.75,19.21 v17.3,19.21
  Bottom 0.127: v4.45,15.88 4.76,15.56 5.79,15.56 6.11,15.24 6.91,15.24 7.06,15.4 15.24,15.4 16.51,16.67 16.51,18.57 17.14,19.21 v17.3,19.21
VBAT  (via drill 0.3)
  Top 0.127: 5.17,16.78 IC6.13 | C11.P$1 | S1.1 2.7,45.08 2.7,44.61 | v6.67,19.68 6.35,20 1.59,20 0.79,20.8 0.79,43.97 1.59,44.77 S1.1 | S1.1 2.67,44.95 | R3.P$2 v11.43,44.29 | S1.1 | 2.67,44.45 S1.1
  Top 0.508: v5.17,16.35 IC6.14 5.17,16.78 | IC5.5 C11.P$1 v14.61,16.98 C10.P$1 | IC6.13 arc0 5.17,16.67
  Bottom 0.127: v6.67,19.68 6.67,16.67 | v11.43,44.29 10.95,44.77 S1.1 2.67,42.68 J3.18
  Bottom 0.508: PAD1.1 0.64,3.49 0.64,12.22 2.38,13.97 2.38,15.88 3.17,16.67 5.24,16.67 | 5.24,16.67 6.67,16.67 14.29,16.67 v14.61,16.98 | v5.17,16.35 5.24,16.42 5.24,16.67
  other vias: 2.67,44.76
VBKP
  Top 0.254: IC7.3 26.19,17.78 26.04,17.62 26.04,17.14 25.4,16.51 17.46,16.51 16.19,17.78 16.19,19.05 15.88,19.37 14.88,19.37 13.61,20.64 13.61,21.75 | 13.61,21.75 13.61,21.47 | 13.61,21.75 C6.P

### Text on the board
tPlace: F | C
bPlace: ESP12E LogBoard v1 / Renan Duarte - 2019 | POWER | RESET | PWR | VBT | P01 | GND | P05 | P03 | P00 | P04 | P15 | P02 | P09 | P10 | P14 | P16 | P13 | P12 | 3V3 | GND | BAT+ | BAT- | TX | RX | CHG | USB
Measures: Cut this trace / to use DS1391 | Jump wire / CD -> GPIO4